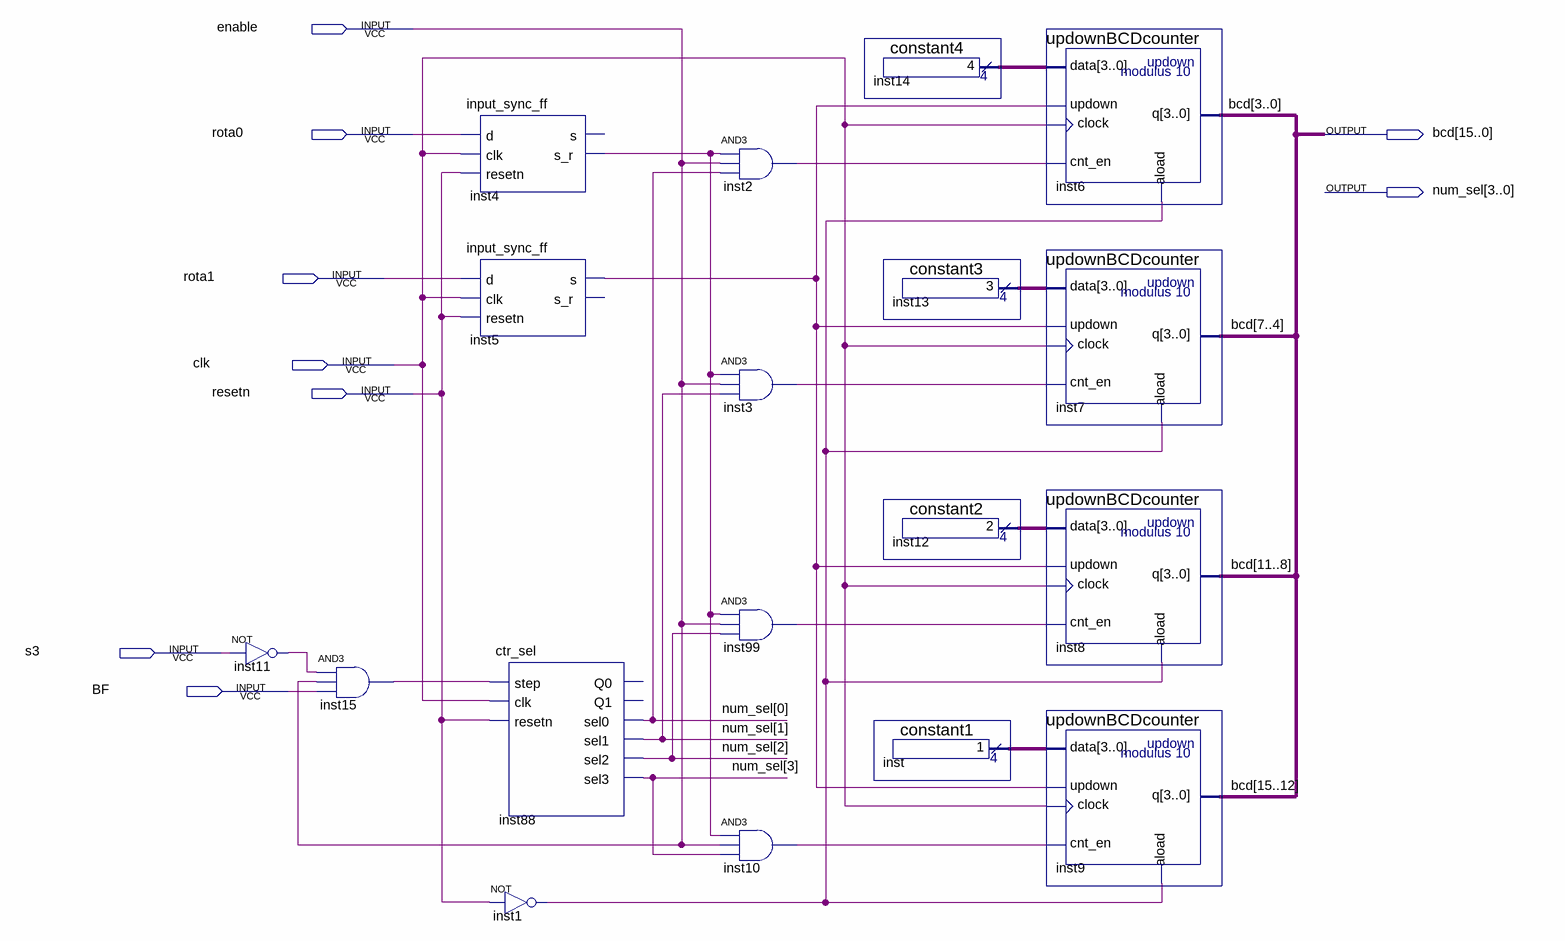
[diagram p0: schematic sheet]
// Quartus schematic rotary_encoder.bdf as structural Verilog: 18 symbols, 9 pins
module rotary_encoder (
  input  enable,
  input  rota0,
  input  rota1,
  input  clk,
  input  resetn,
  input  s3,
  input  BF,
  output [15:0] bcd,
  output [3:0] num_sel
);

  wire inst1_out, inst2_out, inst3_out, inst4_s_r, inst5_s, inst10_out, inst11_out, inst15_out, inst99_out;
  wire [3:0] inst12_result, inst13_result, inst14_result, inst_result;

  not inst11 (inst11_out, s3);
  and inst15 (inst15_out, inst11_out, enable, BF);
  input_sync_ff inst4 (.d(rota0), .clk(clk), .resetn(resetn), .s_r(inst4_s_r));  // open: s
  input_sync_ff inst5 (.d(rota1), .clk(clk), .resetn(resetn), .s(inst5_s));  // open: s_r
  ctr_sel inst88 (
    .step(inst15_out), .clk(clk), .resetn(resetn), .sel0(num_sel[0]), .sel1(num_sel[1]), .sel2(num_sel[2]),
    .sel3(num_sel[3]));  // open: Q0, Q1
  not inst1 (inst1_out, resetn);
  and inst2 (inst2_out, inst4_s_r, enable, num_sel[0]);
  and inst3 (inst3_out, inst4_s_r, enable, num_sel[1]);
  and inst99 (inst99_out, inst4_s_r, enable, num_sel[2]);
  and inst10 (inst10_out, inst4_s_r, enable, num_sel[3]);
  constant4 inst14 (.result(inst14_result));
  constant3 inst13 (.result(inst13_result));
  constant2 inst12 (.result(inst12_result));
  constant1 inst (.result(inst_result));
  updownBCDcounter inst6 (
    .data(inst14_result), .updown(inst5_s), .clock(clk), .cnt_en(inst2_out), .aload(inst1_out), .q(bcd[3:0]));
  updownBCDcounter inst7 (
    .data(inst13_result), .updown(inst5_s), .clock(clk), .cnt_en(inst3_out), .aload(inst1_out), .q(bcd[7:4]));
  updownBCDcounter inst8 (
    .data(inst12_result), .updown(inst5_s), .clock(clk), .cnt_en(inst99_out), .aload(inst1_out), .q(bcd[11:8]));
  updownBCDcounter inst9 (
    .data(inst_result), .updown(inst5_s), .clock(clk), .cnt_en(inst10_out), .aload(inst1_out), .q(bcd[15:12]));
endmodule
